# EAGLE design IR (EAGLE 6.5.0)
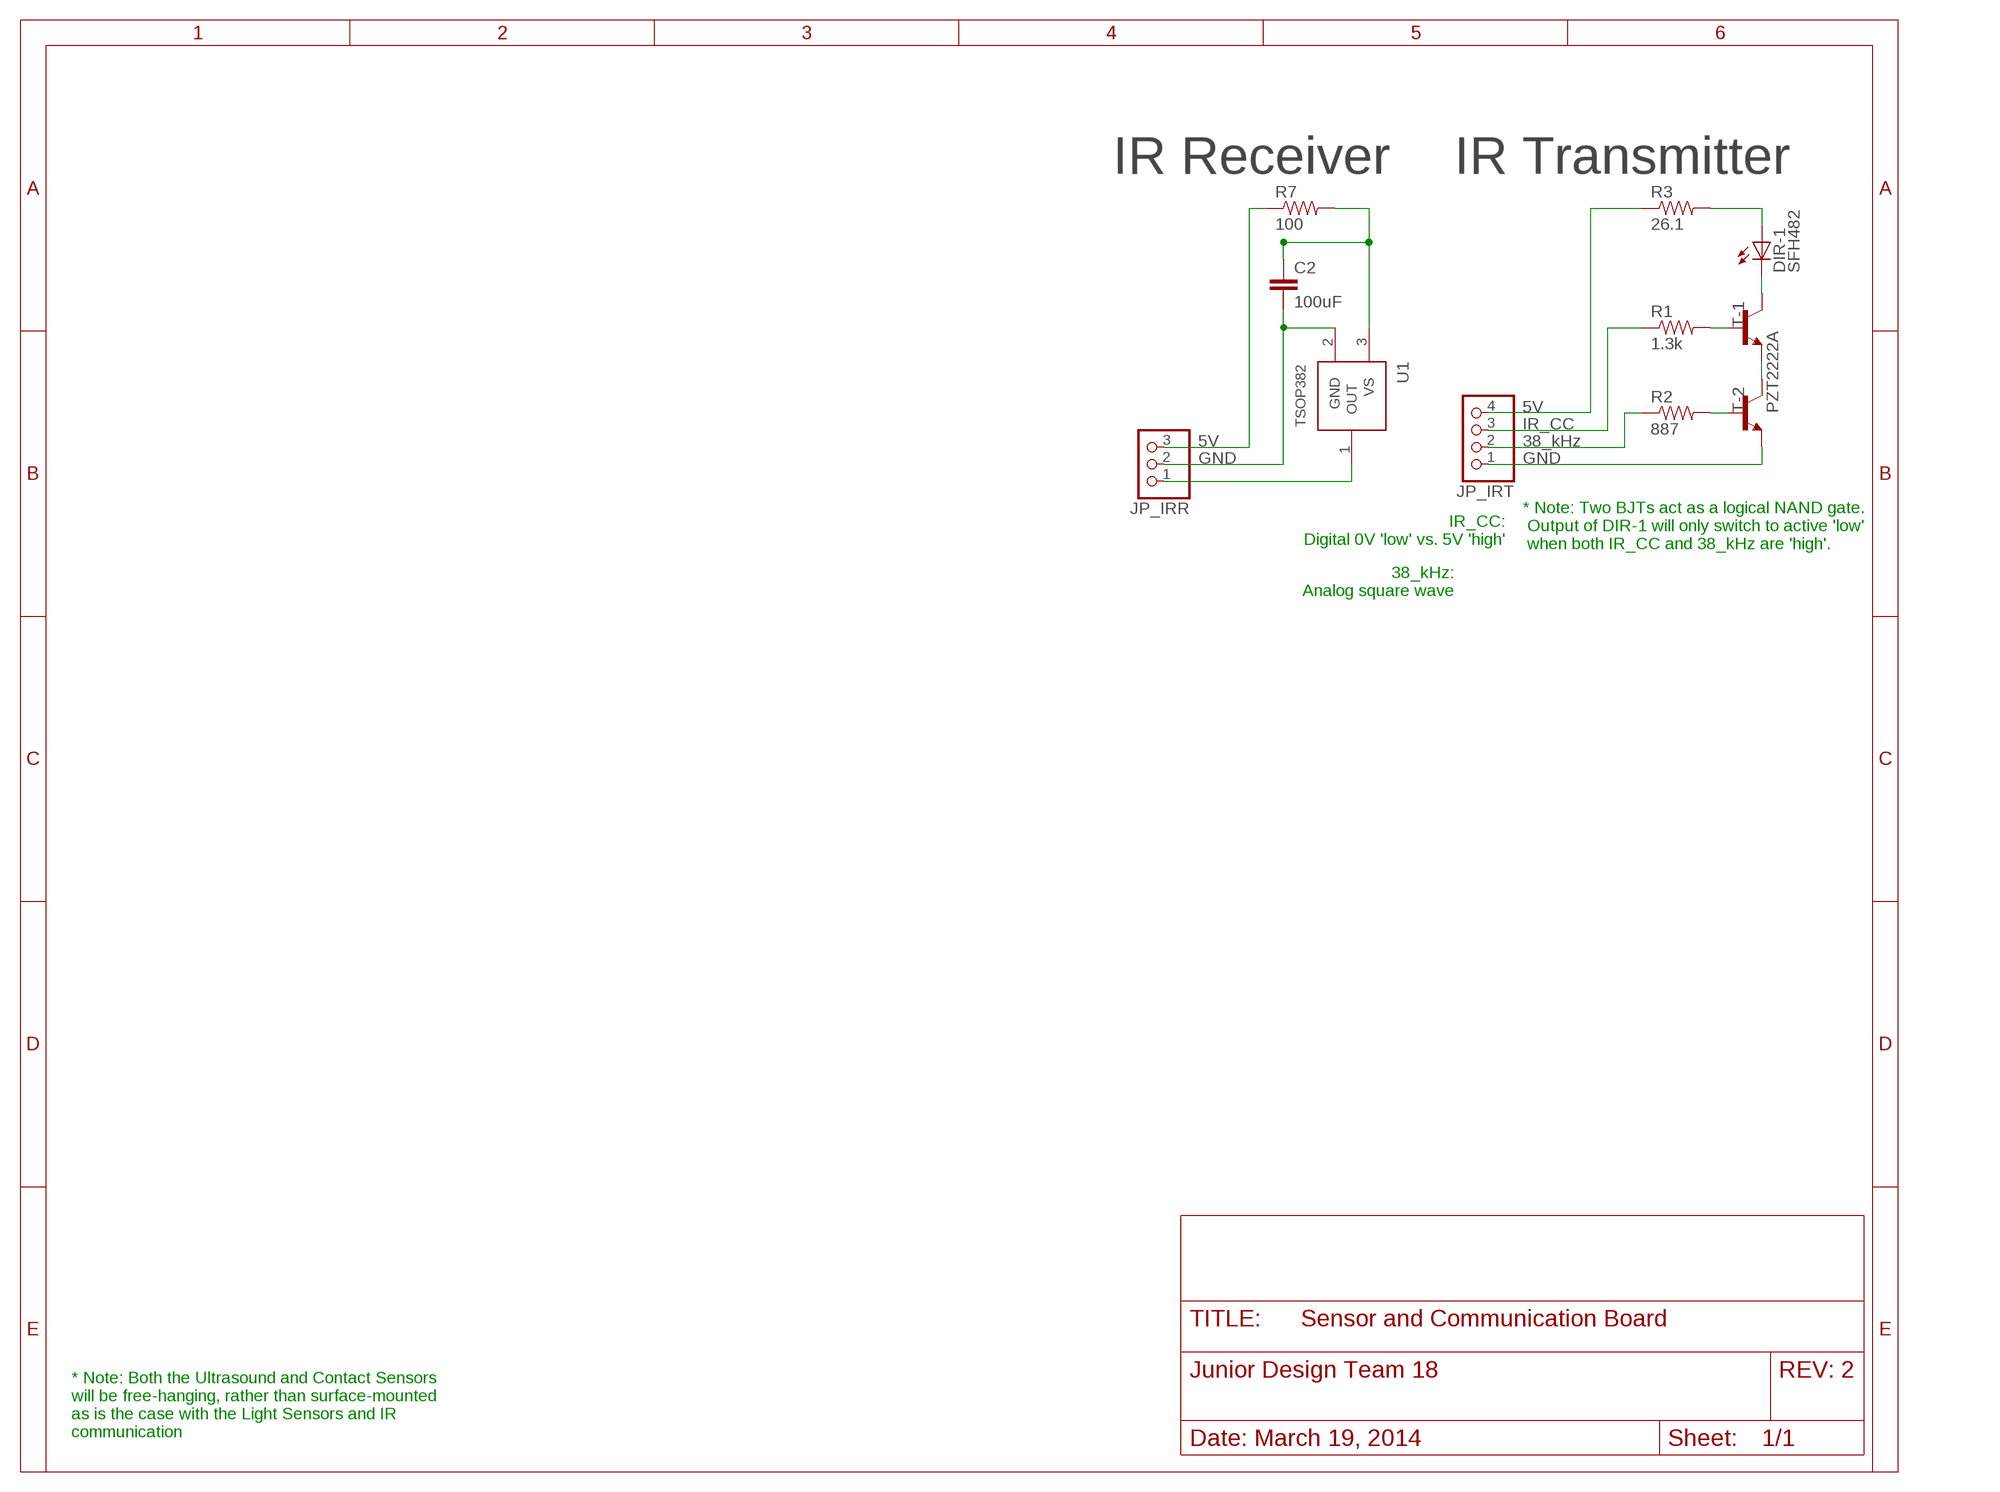
[diagram p0: schematic, sheet 1]

## Parts
C2  100uF  CAP1206  [1206]
DIR-1  SFH482  [SFH482]
JP_IRR  PINHD-1X3  [1X03]
JP_IRT  PINHD-1X4  [1X04]
R1  1.3k  RESISTOR0805-RES  [0805]
R2  887  RESISTOR0805-RES  [0805]
R3  26.1  RESISTOR1206  [1206]
R7  100  RESISTOR0805-RES  [0805]
T-1  PZT2222A  [SOT223]
T-2  PZT2222A  [SOT223]
U1  TSOP382  [TSOP382]

## Nets
GND-IR-R: C2.2 JP_IRR.2 U1.2(GND)
GND-IR-T: JP_IRT.1 T-2.3(E)
N$1: DIR-1.A R3.2
N$2: DIR-1.K(C) T-1.2(C) T-1.4(C)
N$4: R2.2 T-2.1(B)
N$5: R1.2 T-1.1(B)
N$6: T-1.3(E) T-2.2(C) T-2.4(C)
VCC-IR-R: JP_IRR.3 R7.1
VCC-IR-T: JP_IRT.4 R3.1
VIN-IR-1: JP_IRT.3 R1.1
VIN-IR-2: JP_IRT.2 R2.1
VOUT-IR-R: JP_IRR.1 U1.1(OUT)
VS-IR-R: C2.1 R7.2 U1.3(VS)

## Notes on the sheet
- IR Receiver | IR Transmitter
- 5V
- IR_CC
- 5V | 38_kHz
- GND | GND
- IR_CC:
  Digital 0V 'low' vs. 5V 'high'
- * Note: Two BJTs act as a logical NAND gate.
   Output of DIR-1 will only switch to active 'low'
   when both IR_CC and 38_kHz are 'high'.
- 38_kHz:
  Analog square wave
- * Note: Both the Ultrasound and Contact Sensors
  will be free-hanging, rather than surface-mounted
  as is the case with the Light Sensors and IR
  communication

## Library data of the parts
C2 = beacon_board:CAP: Capacitor Standard 0603 ceramic capacitor, and 0.1" leaded capacitor.
DIR-1 = led:SFH482: IR LED infrared emitting diode, Infineon
JP_IRR = pinhead:PINHD-1X3: PIN HEADER
JP_IRT = pinhead:PINHD-1X4: PIN HEADER
R1-R3 R7 = beacon_board:RESISTOR: Resistor Basic schematic elements and footprints for 0603, 1206, and PTH resistors.
T-1 T-2 = beacon_board:PZT2222A
U1 = beacon_board:TSOP382: Vishay IR receiver module

## Net classes
0 default: width 0.152 mm, drill 0.33 mm

## Board
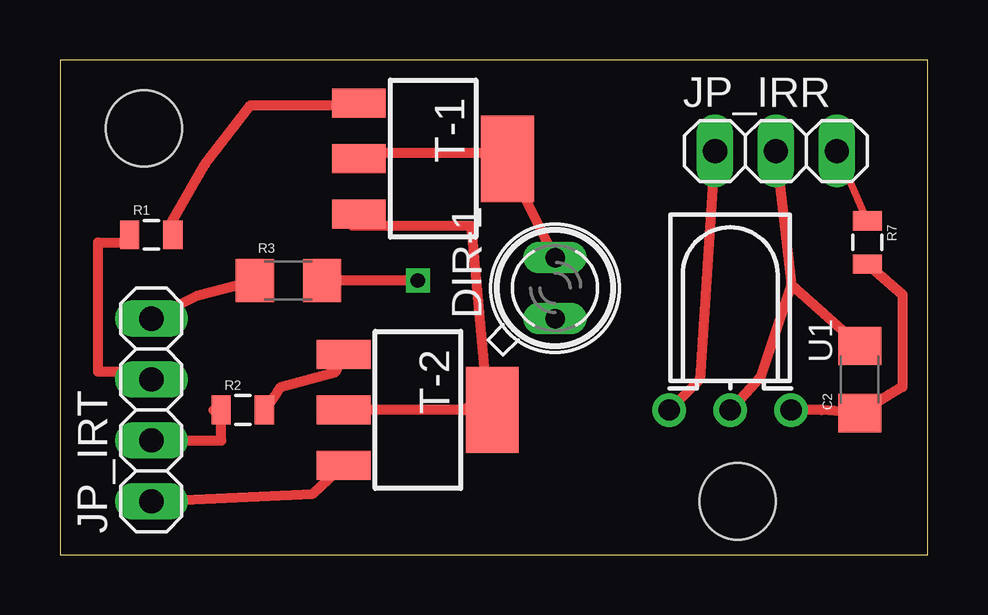
[diagram p1: board, top side]
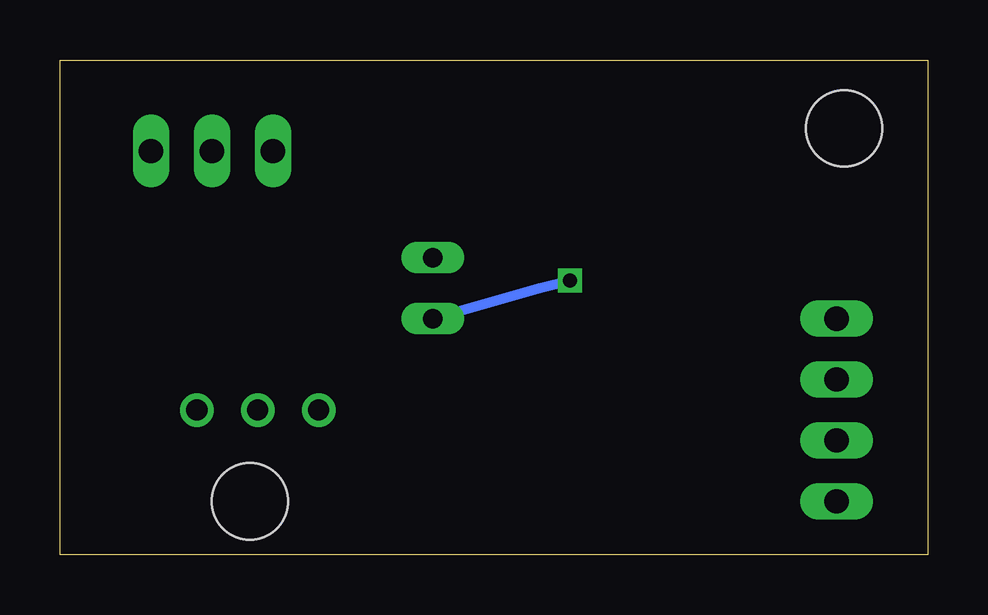
[diagram p2: board, bottom side, seen from below]

Size 36.18 x 20.63 mm. Coordinates in mm from the lower left corner, seen from the top.
Outline: 0,0 36.18,0 36.18,20.63 0,20.63 0,0
Copper layers (1*16): Top 0.035mm / dielectric 1.5mm / Bottom 0.035mm
Design rules "default *": minimum track width 0.001525mm, minimum drill 24mil, track to track 8mil, track to pad 8mil, pad to pad 8mil, via to via 8mil, smd to smd 8mil, copper to edge 40mil, drill to drill 8mil, minimum pad ring 10mil, minimum via ring 8mil, stop-mask expansion 4mil, vias tented up to drill 0mil, thermal gap 10mil
Holes 3.17 mm at 28.26,2.22 3.49,17.78

### Footprints (pad centres in the part's own frame; a part is rotated, then mirrored left to right if it is on the bottom)
1206 = smd 1.6 x 1.8: 1 -1.4,0; 2 1.4,0
SFH482 = drill 0.813 long: A -1.27,0; K 1.27,0
1X03 = drill 1.016 long: 1 -2.54,0; 2 0,0; 3 2.54,0
1X04 = drill 1.016 long: 1 -3.81,0; 2 -1.27,0; 3 1.27,0; 4 3.81,0
0805 = smd 0.8 x 1.2: 1 -0.9,0; 2 0.9,0
SOT223 = smd 1.219 x 2.235: 1 -2.311,-3.099; 2 0,-3.099; 3 2.311,-3.099 | smd 3.6 x 2.2: 4 0,3.099
TSOP382 = drill 0.889: 1 -2.54,0; 2 0,0; 3 2.54,0

### Placement (x,y rotation side)
C2  33.34,7.3 90 top
DIR-1  20.64,11.11 90 top
JP_IRR  29.84,16.83 0 top
JP_IRT  3.81,6.03 90 top
R1  3.81,13.34 0 top
R2  7.62,6.03 0 top
R3  9.53,11.43 0 top
R7  33.66,13.02 270 top
T-1  15.56,16.51 270 top
T-2  14.92,6.03 270 top
U1  27.94,6.03 0 top

### Tracks (layer width: path | path; a pad name or v marks a point on that pad's centre or on a via)
GND-IR-R
  Top 0.406: U1.2 29.21,7.43 30.48,11.24 | JP_IRR.2 30.48,11.24 | 30.48,11.24 C2.2
GND-IR-T
  Top 0.406: JP_IRT.1 10.55,2.54 T-2.3
N$1  (via drill 0.6)
  Top 0.152: 10.67,10.67 R3.2
  Top 0.406: v14.92,11.43 R3.2
  Bottom 0.406: DIR-1.A 16.19,11.11 v14.92,11.43
N$2
  Top 0.152: 12.19,16.76 T-1.2 | 18.29,16.76 T-1.4
  Top 0.406: 12.19,16.76 18.66,16.76 T-1.4 18.66,15.88 19.37,14.92 DIR-1.K
N$4
  Top 0.406: R2.2 8.57,6.03 9.21,6.99 11.51,7.62 T-2.1
N$5
  Top 0.152: 4.57,13.72 R1.2 | 12.19,18.29 T-1.1
  Top 0.406: 4.57,13.72 6.03,16.26 7.94,18.73 12.46,18.73 T-1.1
N$6
  Top 0.152: 12.19,13.72 T-1.3
  Top 0.406: 12.19,13.72 17.14,13.72 17.78,6.67 | 16.83,6.03 17.78,6.67 | T-2.2 T-2.4 17.78,6.03 17.78,6.67
VCC-IR-R
  Top 0.305: JP_IRR.3 R7.1
VCC-IR-T
  Top 0.152: 7.62,10.67 R3.1
  Top 0.406: JP_IRT.4 5.71,10.79 R3.1
VIN-IR-1
  Top 0.152: 3.05,13.72 R1.1
  Top 0.406: R1.1 2.91,13.02 1.59,13.02 1.59,7.62 3.81,7.62 JP_IRT.3
VIN-IR-2
  Top 0.406: 6.4,6.03 R2.1 6.72,4.76 JP_IRT.2
VOUT-IR-R
  Top 0.406: JP_IRR.1 26.67,7.3 U1.1
VS-IR-R
  Top 0.406: U1.3 31.75,6.03 C2.1 35.12,6.99 35.12,10.85 R7.2